# EAGLE design piboard (EAGLE 6.1)
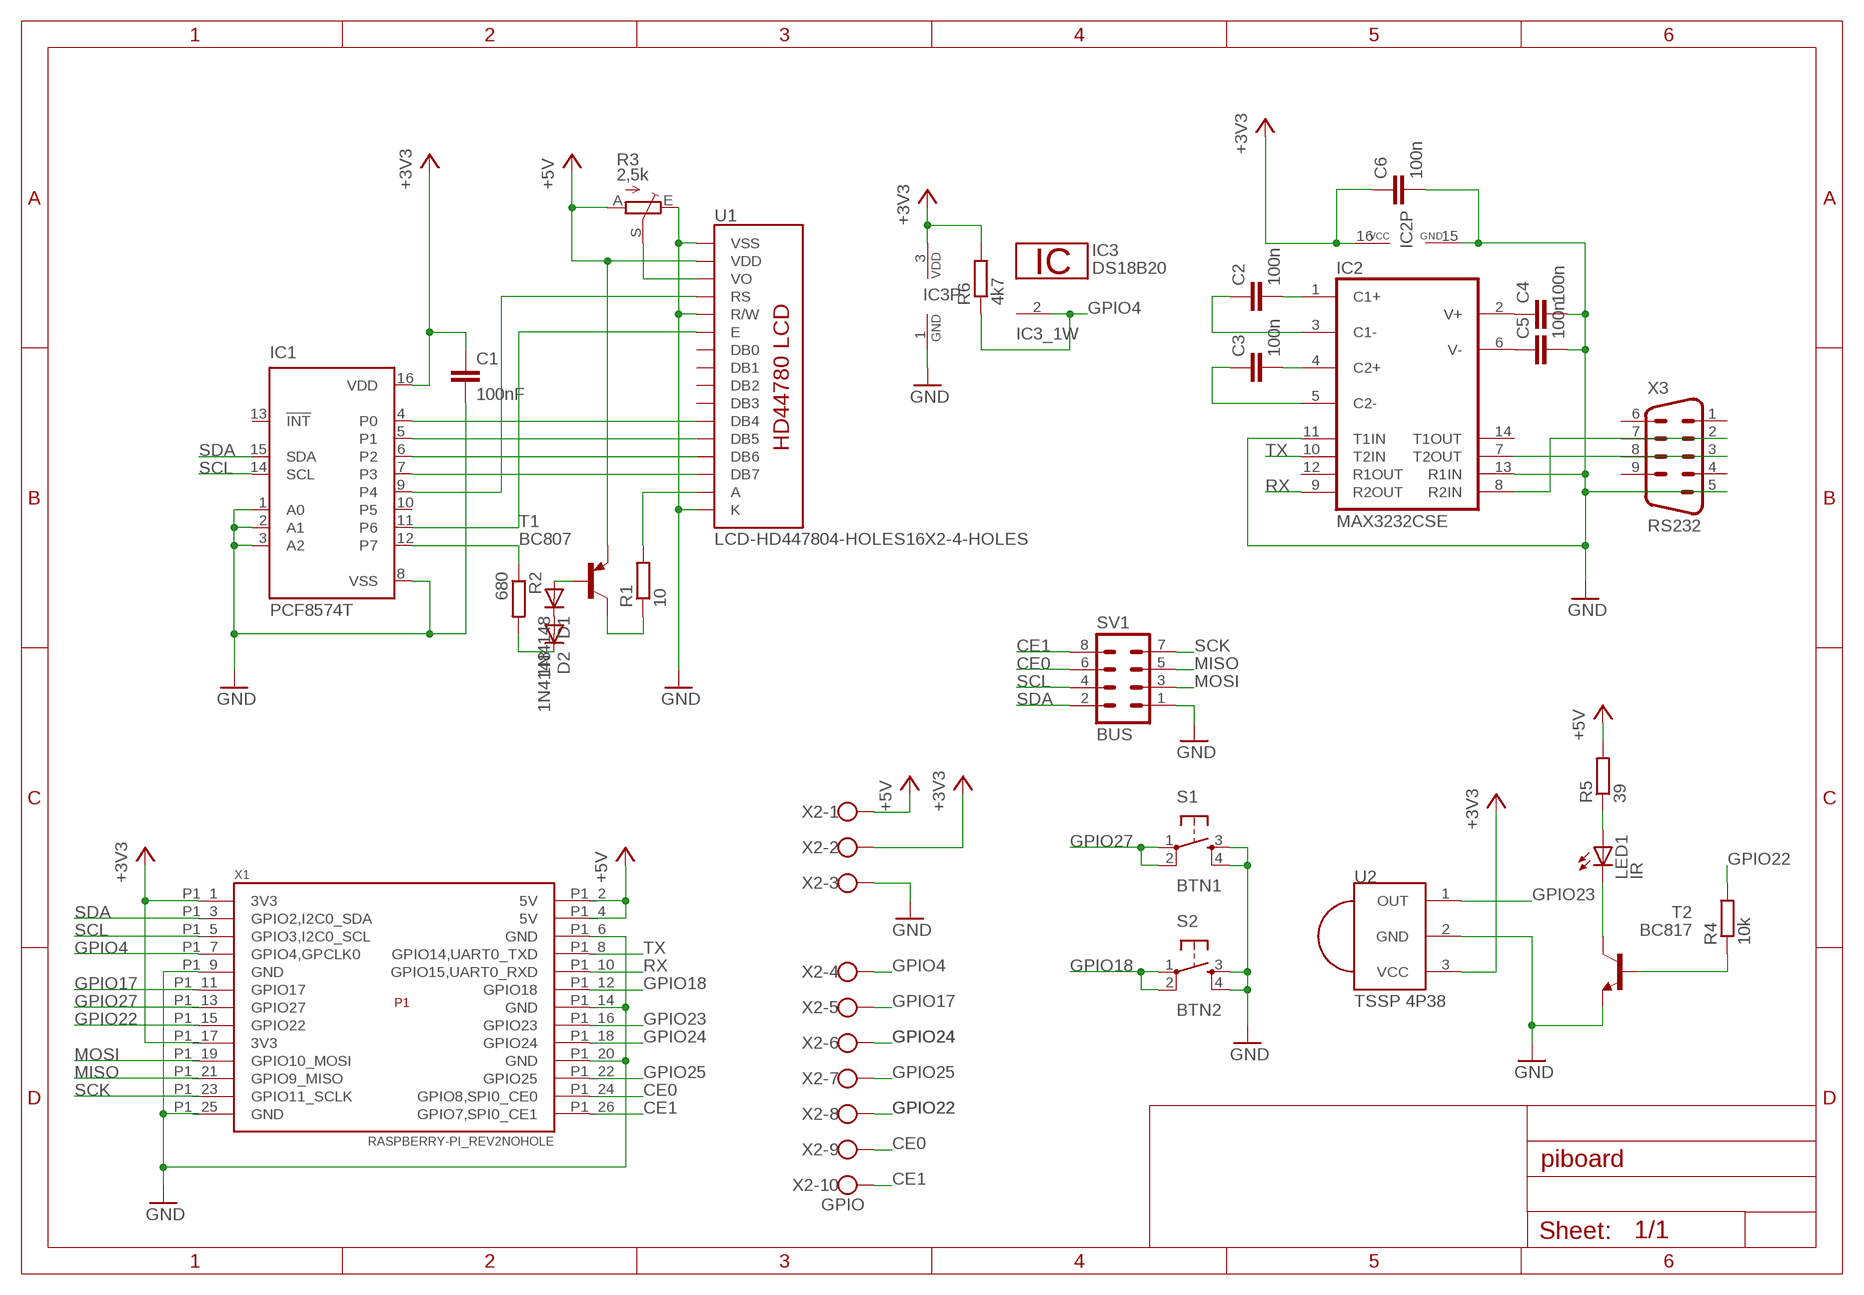
[diagram p0: schematic, sheet 1]

## Parts
C1  100nF  C-EUC0805  [C0805]
C2  100n  C-EUC0805  [C0805]
C3  100n  C-EUC0805  [C0805]
C4  100n  C-EUC0805  [C0805]
C5  100n  C-EUC0805  [C0805]
C6  100n  C-EUC0805  [C0805]
D1  1N4148  DIODE-SOD80C  [SOD80C]
D2  1N4148  DIODE-SOD80C  [SOD80C]
IC1  PCF8574T  [SO16W]
IC2  MAX3232CSE  [SO16]
IC3  DS18B20  [TO92-]
LED1  IR  LED5MM  [LED5MM]
R1  10  R-EU_R0805  [R0805]
R2  680  R-EU_R0805  [R0805]
R3  2,5k  TRIM_EU-2  [LI6]
R4  10k  R-EU_R0805  [R0805]
R5  39  R-EU_R0805  [R0805]
R6  4k7  R-EU_R0805  [R0805]
S1  BTN1  TAC_SWITCHPTH  [TACTILE-PTH]
S2  BTN2  TAC_SWITCHPTH  [TACTILE-PTH]
SV1  BUS  MA04-2  [MA04-2]
T1  BC807  BC807-16-PNP-SOT23-BEC  [SOT23-BEC]
T2  BC817  BC817-16-NPN-SOT23-BEC  [SOT23-BEC]
U1  LCD-HD447804-HOLES16X2-4-HOLES  [LCD-16X2-4HOLES]
U2  TSSP 4P38  PNA460XM  [PNA460XM]
X1  RASPBERRY-PI_REV2NOHOLE  [RASPBERRY-PI_REV2_NOHOLE]
X2  GPIO  AKL059-10  [RIA059-10]
X3  RS232  M09HP  [M09HP]

## Nets
+3V3: C1.1 C6.1 IC1.16(VDD) IC2.16(VCC) IC3.3 R6.2 U2.3(VCC) X1.P1_1(3V3) X1.P1_17(3V3) X2.2
+5V: R3.A R5.2 T1.E U1.2(VDD) X1.P1_2(5V) X1.P1_4(5V) X2.1
CE0: SV1.6 X1.P1_24(GPIO8,SPI0_CE0) X2.9
CE1: SV1.8 X1.P1_26(GPIO7,SPI0_CE1) X2.10
GND: C1.2 C4.2 C5.2 C6.2 IC1.1(A0) IC1.2(A1) IC1.3(A2) IC1.8(VSS) IC2.11(T1IN) IC2.13(R1IN) IC2.15(GND) IC3.1 R3.E S1.3 S1.4 S2.3 S2.4 SV1.1 T2.E U1.1(VSS) U1.5(R/W) U1.16(K) U2.2(GND) X1.P1_6(GND) X1.P1_9(GND) X1.P1_14(GND) X1.P1_20(GND) X1.P1_25(GND) X2.3 X3.5
GPIO4: IC3.2 R6.1 X1.P1_7(GPIO4,GPCLK0) X2.4
GPIO17: X1.P1_11(GPIO17) X2.5
GPIO18: S2.1 S2.2 X1.P1_12(GPIO18)
GPIO22: R4.2 X1.P1_15(GPIO22) X2.8
GPIO23: U2.1(OUT) X1.P1_16(GPIO23)
GPIO24: X1.P1_18(GPIO24) X2.6
GPIO25: X1.P1_22(GPIO25) X2.7
GPIO27: S1.1 S1.2 X1.P1_13(GPIO27)
MISO: SV1.5 X1.P1_21(GPIO9_MISO)
MOSI: SV1.3 X1.P1_19(GPIO10_MOSI)
N$1: R1.1 T1.C
N$2: IC1.9(P4) U1.4(RS)
N$3: IC1.4(P0) U1.11(DB4)
N$4: IC1.5(P1) U1.12(DB5)
N$5: IC1.6(P2) U1.13(DB6)
N$6: IC1.7(P3) U1.14(DB7)
N$7: IC1.11(P6) U1.6(E)
N$8: R1.2 U1.15(A)
N$9: IC1.12(P7) R2.1
N$10: D1.A T1.B
N$11: D1.C D2.A
N$12: D2.C R2.2
N$13: R3.S U1.3(VO)
N$14: C2.2 IC2.1(C1+)
N$15: C3.2 IC2.4(C2+)
N$16: C2.1 IC2.3(C1-)
N$17: C3.1 IC2.5(C2-)
N$18: IC2.7(T2OUT) X3.3
N$19: IC2.8(R2IN) X3.2
N$20: C4.1 IC2.2(V+)
N$21: C5.1 IC2.6(V-)
N$22: R4.1 T2.B
N$23: LED1.A R5.1
N$24: LED1.K(C) T2.C
RX: IC2.9(R2OUT) X1.P1_10(GPIO15,UART0_RXD)
SCK: SV1.7 X1.P1_23(GPIO11_SCLK)
SCL: IC1.14(SCL) SV1.4 X1.P1_5(GPIO3,I2C0_SCL)
SDA: IC1.15(SDA) SV1.2 X1.P1_3(GPIO2,I2C0_SDA)
TX: IC2.10(T2IN) X1.P1_8(GPIO14,UART0_TXD)
Unconnected: IC1.10(P5) IC1.13(!INT) IC2.12(R1OUT) IC2.14(T1OUT) U1.7(DB0) U1.8(DB1) U1.9(DB2) U1.10(DB3) X3.1 X3.4 X3.6 X3.7 X3.8 X3.9

## Library data of the parts
C1-C6 = resistor:C-EU: CAPACITOR, European symbol
D1 D2 = diode:DIODE-: DIODE
IC1 = micro-philips:PCF8574: I2C-Bus Remote 8-bit I/O expander http://www.semiconductors.philips.com/acrobat_download/datasheets/PCF8574_4.pdf; MPN: PCF8574T/3,512; OC_FARNELL: 1201255; OC_NEWARK: 70R6870
IC2 = maxim:MAX3232*: True RS-232 Transceivers 3.0V to 5.5V, Low-Power up to 1Mbps, Using Four 0.1µF External Capacitors Source: http://pdfserv.maxim-ic.com/en/ds/MAX3222-MAX3241.pdf; MPN: MAX3232CSE; OC_FARNELL: 9725490; OC_NEWARK: 90C2890
IC3 = 1wire:DS18B20: Programmable Resolution Digital Thermometer This chip provides a onewire thermosensor with approx. 0.5°C accuracy. A programmable over/undertemperure alarm is available. The precision can be set from 9..12 bits. Notes: Vdd must be applied for accurate measurements at low temperatures, as the parasite power circuit otherwise heats the sensor. If parasite power is used, Vdd has to be connected to GND. The DS1822 is a low-cost thermometer chip, the DS18S20 is similar to the DS18B20, but with 9 Bit precision only. Author: Jan Kandziora <jjj@gmx.de>
LED1 = led:LED: LED OSRAM: - CHIPLED LG R971, LG N971, LY N971, LG Q971, LY Q971, LO R971, LY R971 LH N974, LH R974 LS Q976, LO Q976, LY Q976 LO Q996 - Hyper CHIPLED LW Q18S LB Q993, LB Q99A, LB R99A - SideLED LS A670, LO A670, LY A670, LG A670, LP A670 LB A673, LV A673, LT A673, LW A673 LH A674 LY A675 LS A676, LA A676, LO A676, LY A676, LW A676 LS A679, LY A679, LG A679 - Hyper Micro SIDELED® LS Y876, LA Y876, LO Y876, LY Y876 LT Y87S - SmartLED LW L88C, LW L88S LB L89C, LB L89S, LG L890 LS L89K, LO L89K, LY L89K LS L896, LA L896, LO L896, LY L896 - TOPLED LS T670, LO T670, LY T670, LG T670, LP T670 LSG T670, LSP T670, LSY T670, LOP T670, LYG T670 LG T671, LOG T671, LSG T671 LB T673, LV T673, LT T673, LW T673 LH T674 LS T676, LA T676, LO T676, LY T676, LB T676, LH T676, LSB T676, LW T676 LB T67C, LV T67C, LT T67C, LS T67K, LO T67K, LY T67K, LW E67C LS E67B, LA E67B, LO E67B, LY E67B, LB E67C, LV E67C, LT E67C LW T67C LS T679, LY T679, LG T679 LS T770, LO T770, LY T770, LG T770, LP T770 LB T773, LV T773, LT T773, LW T773 LH T774 LS E675, LA E675, LY E675, LS T675 LS T776, LA T776, LO T776, LY T776, LB T776 LHGB T686 LT T68C, LB T68C - Hyper Mini TOPLED® LB M676 - Mini TOPLED Santana® LG M470 LS M47K, LO M47K, LY M47K Source: http://www.osram.convergy.de LUXEON: - LUMILED® LXK2-PW12-R00, LXK2-PW12-S00, LXK2-PW14-U00, LXK2-PW14-V00 LXK2-PM12-R00, LXK2-PM12-S00, LXK2-PM14-U00 LXK2-PE12-Q00, LXK2-PE12-R00, LXK2-PE12-S00, LXK2-PE14-T00, LXK2-PE14-U00 LXK2-PB12-K00, LXK2-PB12-L00, LXK2-PB12-M00, LXK2-PB14-N00, LXK2-PB14-P00, LXK2-PB14-Q00 LXK2-PR12-L00, LXK2-PR12-M00, LXK2-PR14-Q00, LXK2-PR14-R00 LXK2-PD12-Q00, LXK2-PD12-R00, LXK2-PD12-S00 LXK2-PH12-R00, LXK2-PH12-S00 LXK2-PL12-P00, LXK2-PL12-Q00, LXK2-PL12-R00 Source: www.luxeon.com KINGBRIGHT: KA-3528ASYC Source: www.kingbright.com
R1 R2 R4-R6 = resistor:R-EU_: RESISTOR, European symbol
R3 = pot-2:TRIM_EU-2: POTENTIOMETER Edited by Endres
S1 S2 = SparkFun_eagle5:TAC_SWITCH: Momentary Switch Button commonly used for reset or general input. Spark Fun Electronics SKU : COM-00097
SV1 = con-lstb:MA04-2: PIN HEADER; OC_FARNELL: unknown; OC_NEWARK: unknown
T1 = transistor:*-PNP-: PNP Transistror
T2 = transistor:*-NPN-: NPN Transistror BF959 corrected 2008.03.06
U1 = HD44780LCD:LCD-HD44780
U2 = adafruit-eagle610:PNA460XM: IR 38KHz receiver PNA4602 and related receivers http://www.ladyada.net/library/pcb/eaglelibrary.html
X1 = RaspberryPi_withoutP5:RASPBERRY-PI_REV2: Raspberry Pi Board <http://www.raspberrypi.org/> Jacques Lagnel V1.0 (beta) 2012 Mateusz Bawaj V1.1 (beta) 2012 Board dimension: Forum 3D model <http://www.raspberrypi.org/forum/general-discussion/mechanical-profile-3d-models?value=3d%20model&type=1&include=1&search=1&ret=all> The GPIO Connector (P1): http://elinux.org/RPi_Low-level_peripherals The GPIO Connector (P5): http://www.raspberrypi-spy.co.uk/2012/09/raspberry-pi-p5-header/
X2 = con-reichelt2:AKL059-10: Reichelt: AKL 059-04; OC_FARNELL: unknown; OC_NEWARK: unknown
X3 = con-subd:M09: SUB-D; OC_FARNELL: unknown; OC_NEWARK: unknown

## Board
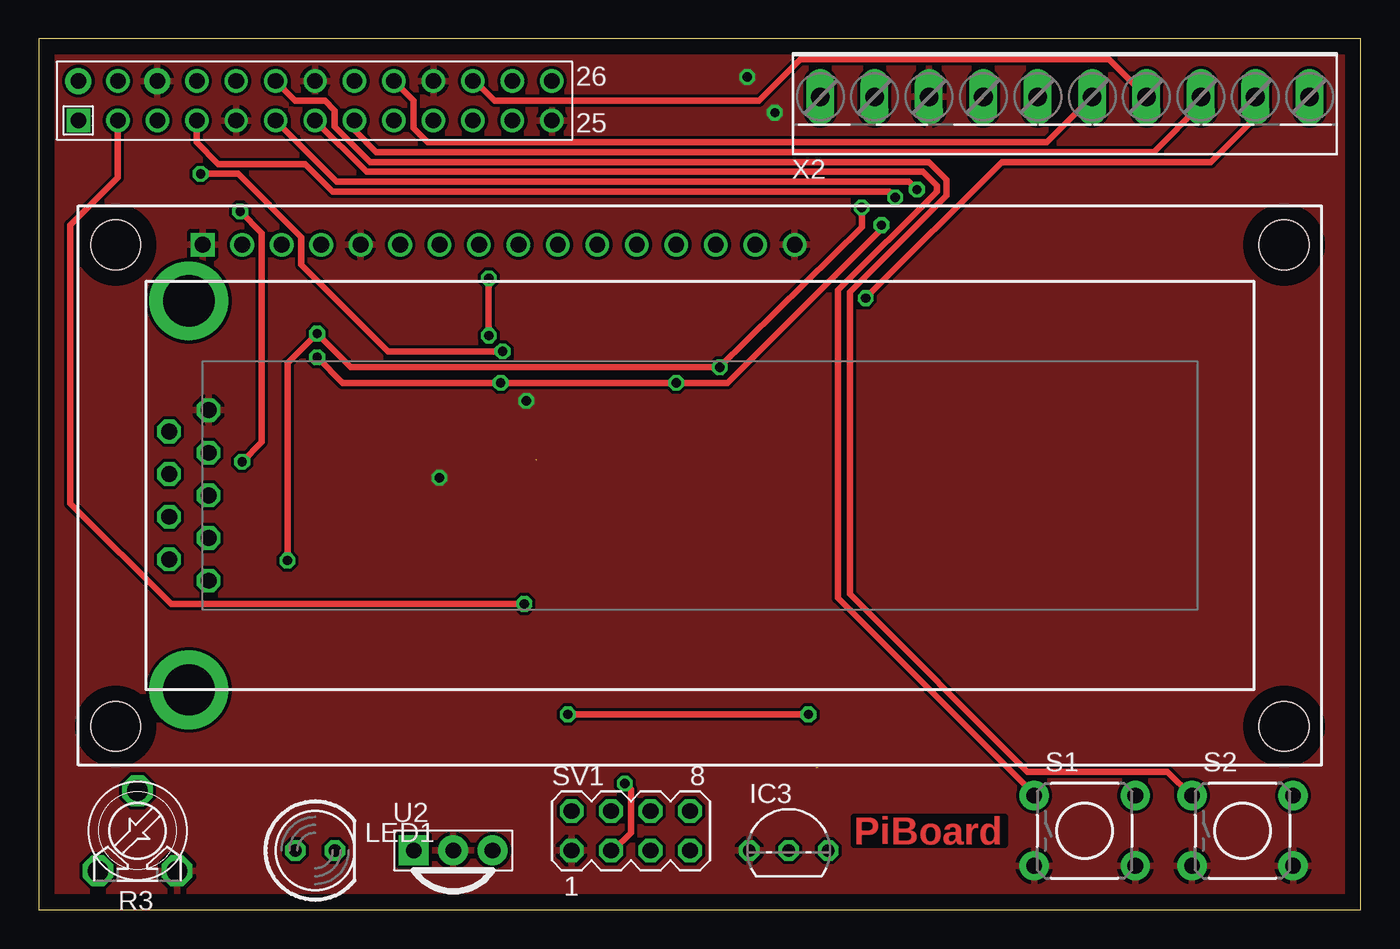
[diagram p1: board, top side]
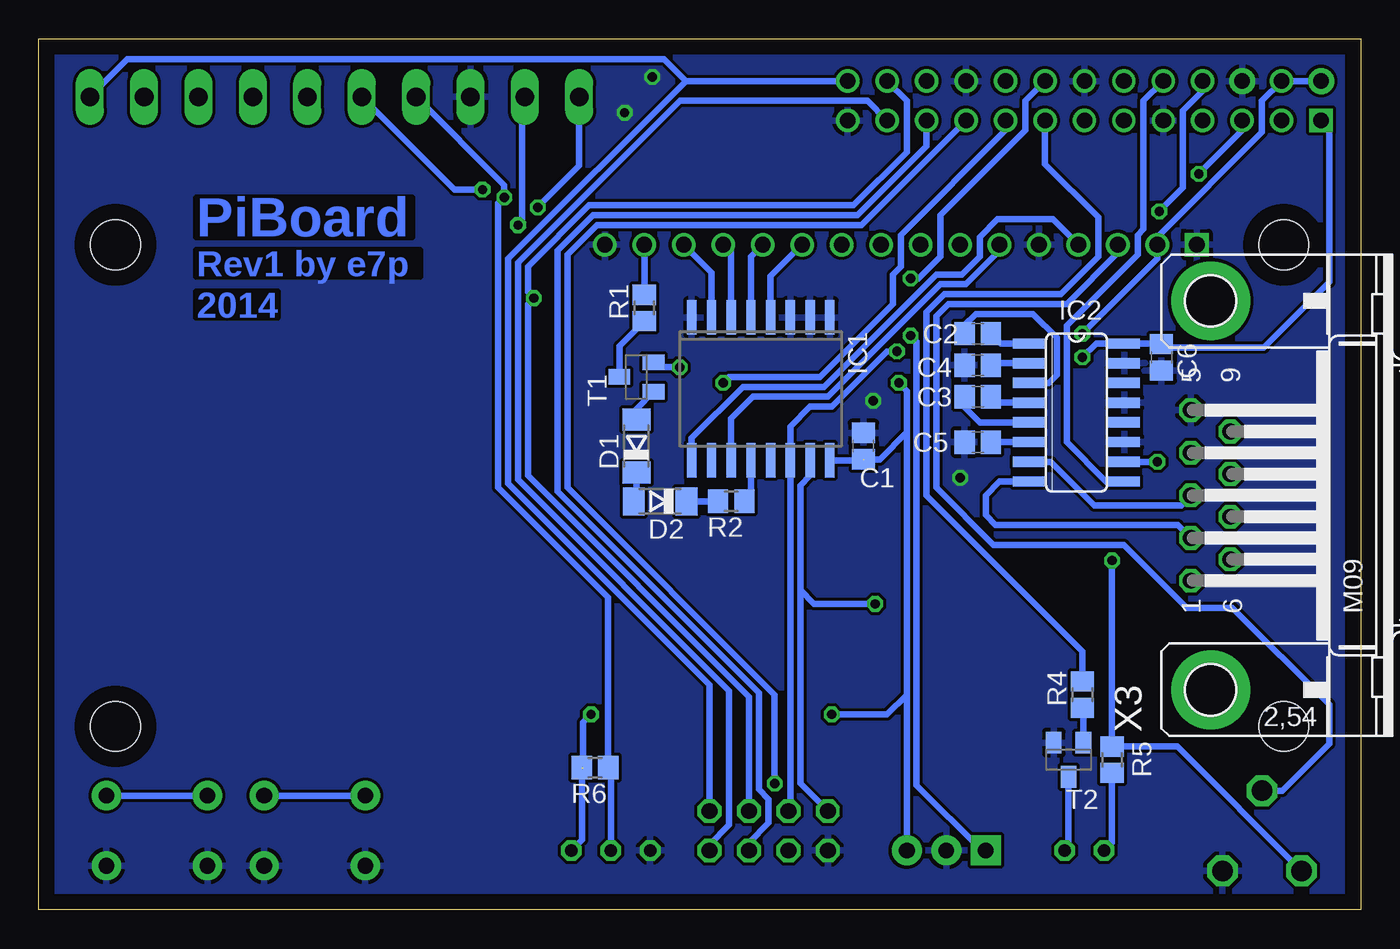
[diagram p2: board, bottom side, seen from below]

Size 85.07 x 56.06 mm. Coordinates in mm from the lower left corner, seen from the top.
Outline: 0,0 85.07,0 85.07,56.06 0,56.06 0,0
Copper layers (1*16): Top 0.035mm / dielectric 1.5mm / Bottom 0.035mm
Design rules: minimum track width 10mil, minimum drill 0.3mm, track to track 8mil, track to pad 8mil, pad to pad 8mil, via to via 8mil, smd to smd 8mil, copper to edge 40mil, drill to drill 8mil, minimum pad ring 10mil, minimum via ring 8mil, stop-mask expansion 4mil, vias tented up to drill 0mil, thermal gap 10mil
Milling: 4 lines

### Footprints (pad centres in the part's own frame; a part is rotated, then mirrored left to right if it is on the bottom)
C0805 = smd 1.3 x 1.5: 1 -0.85,0; 2 0.85,0
SOD80C = smd 1.4 x 1.8: A 1.7,0; C -1.7,0
SO16W = smd 0.6 x 2.2: 1 -4.445,-4.6; 2 -3.175,-4.6; 3 -1.905,-4.6; 4 -0.635,-4.6; 5 0.635,-4.6; 6 1.905,-4.6; 7 3.175,-4.6; 8 4.445,-4.6; 9 4.445,4.6; 10 3.175,4.6; 11 1.905,4.6; 12 0.635,4.6; 13 -0.635,4.6; 14 -1.905,4.6; 15 -3.175,4.6; 16 -4.445,4.6
SO16 = smd 0.66 x 2.032: 1 -4.445,-3.073; 2 -3.175,-3.073; 3 -1.905,-3.073; 4 -0.635,-3.073; 5 0.635,-3.073; 6 1.905,-3.073; 7 3.175,-3.073; 8 4.445,-3.073; 9 4.445,3.073; 10 3.175,3.073; 11 1.905,3.073; 12 0.635,3.073; 13 -0.635,3.073; 14 -1.905,3.073; 15 -3.175,3.073; 16 -4.445,3.073
TO92- = drill 0.813 octagon: 1 -2.54,0; 2 0,0; 3 2.54,0
LED5MM = drill 0.813 octagon: A -1.27,0; K 1.27,0
R0805 = smd 1.3 x 1.5: 1 -0.85,0; 2 0.85,0
LI6 = drill 1.321 octagon: A -2.54,-2.58; E 2.54,-2.58; S 0,2.58
TACTILE-PTH = drill 1.016 pad 1.88: 1 -3.251,2.261; 2 3.251,2.261; 3 -3.251,-2.261; 4 3.251,-2.261
MA04-2 = drill 1.016 octagon: 1 -3.81,-1.27; 2 -3.81,1.27; 3 -1.27,-1.27; 4 -1.27,1.27; 5 1.27,-1.27; 6 1.27,1.27; 7 3.81,-1.27; 8 3.81,1.27
SOT23-BEC = smd 1 x 1.4: B -0.95,-1.1; C 0,1.1; E 0.95,-1.1
LCD-16X2-4HOLES = drill 1.016 square: 1 -32,15.5 | drill 1.016: 2 -29.46,15.5; 3 -26.92,15.5; 4 -24.38,15.5; 5 -21.84,15.5; 6 -19.3,15.5; 7 -16.76,15.5; 8 -14.22,15.5; 9 -11.68,15.5; 10 -9.14,15.5; 11 -6.6,15.5; 12 -4.06,15.5; 13 -1.52,15.5; 14 1.02,15.5; 15 3.56,15.5; 16 6.1,15.5 | hole 3.2: -37.6,15.5; -37.6,-15.5; 37.6,-15.5; 37.6,15.5
PNA460XM = drill 1.016 pad 1.93 square: 1 -2.54,0 | drill 1.016 pad 1.93: 2 0,0; 3 2.54,0
RASPBERRY-PI_REV2_NOHOLE = drill 1 square: P1_1 -41.91,21.59 | drill 1 pad 1.676: P1_2 -41.91,24.13; P1_6 -36.83,24.13 | drill 1: P1_3 -39.37,21.59; P1_4 -39.37,24.13; P1_5 -36.83,21.59; P1_7 -34.29,21.59; P1_8 -34.29,24.13; P1_9 -31.75,21.59; P1_10 -31.75,24.13; P1_11 -29.21,21.59; P1_12 -29.21,24.13; P1_13 -26.67,21.59; P1_14 -26.67,24.13; P1_15 -24.13,21.59; P1_16 -24.13,24.13; P1_17 -21.59,21.59; P1_18 -21.59,24.13; P1_19 -19.05,21.59; P1_20 -19.05,24.13; P1_21 -16.51,21.59; P1_22 -16.51,24.13; P1_23 -13.97,21.59; P1_24 -13.97,24.13; P1_25 -11.43,21.59; P1_26 -11.43,24.13
RIA059-10 = drill 1.194 long: 1 -15.75,-1.27; 2 -12.25,-1.27; 3 -8.75,-1.27; 4 -5.25,-1.27; 5 -1.75,-1.27; 6 1.75,-1.27; 7 5.25,-1.27; 8 8.75,-1.27; 9 12.25,-1.27; 10 15.75,-1.27
M09HP = drill 1.016 octagon: 1 -5.486,1.27; 2 -2.743,1.27; 3 0,1.27; 4 2.743,1.27; 5 5.486,1.27; 6 -4.115,-1.27; 7 -1.372,-1.27; 8 1.372,-1.27; 9 4.115,-1.27 | drill 3.302 pad 5.08: G1 -12.522,0; G2 12.522,0

### Placement (x,y rotation side)
C1  32,29.84 90 bottom
C2  24.64,37.08 0 bottom
C3  24.64,33.02 0 bottom
C4  24.64,35.05 180 bottom
C5  24.64,30.1 180 bottom
C6  12.83,35.56 270 bottom
D1  46.61,29.84 90 bottom
D2  45.09,26.29 180 bottom
IC1  38.61,33.53 180 bottom
IC2  18.29,32 270 bottom
IC3  48.26,3.81 0 top
LED1  17.78,3.81 0 top
R1  46.1,38.73 90 bottom
R2  40.51,26.29 180 bottom
R3  6.35,5.08 0 top
R4  17.91,13.84 90 bottom
R5  16,9.65 90 bottom
R6  49.28,9.14 180 bottom
S1  67.31,5.08 0 top
S2  77.47,5.08 0 top
SV1  38.1,5.08 0 top
T1  46.61,34.29 90 bottom
T2  18.8,9.65 180 bottom
U1  42.55,27.3 0 top
U2  26.67,3.81 0 top
X1  44.45,29.21 0 top
X2  66.04,53.59 0 top
X3  9.65,26.67 90 bottom

### Tracks (layer width: path | path; a pad name or v marks a point on that pad's centre or on a via)
+3V3  (via drill 0.6)  (2 unrouted)
  Top 0.406: v17.91,35.56 19.56,33.91 v29.72,33.91 v41.02,33.91 44.32,33.91 54.23,43.81 v54.23,44.07 | v49.53,12.57 v34.04,12.57
  Bottom 0.406: X1.P1_1 2.03,50.29 2.03,40.39 6.22,36.2 12.19,36.2 12.41,36.41 C6.1 12.61,36.45 IC2.16 17.02,36.45 v17.91,35.56 | IC1.16 32.16,28.93 32.13,28.96 32,28.96 | U2.3 29.21,13.84 | 29.21,13.84 29.21,30.73 | 29.21,30.73 30.95,29 C1.1 | R6.2 50.13,4.48 IC3.3 | 29.21,30.73 29.21,33.4 v29.72,33.91 | v34.04,12.57 30.48,12.57 29.21,13.84 | 50.04,9.14 50.04,12.06 v49.53,12.57 | v54.23,44.07 53.98,44.32 53.98,52.14 X2.2 | X1.P1_17 22.86,50.16 29.59,43.43 29.59,41.4 30.1,40.89 30.1,38.99 34.8,34.29 40.64,34.29 v41.02,33.91
+5V  (via drill 0.6)
  Top 0.406: v16,22.48 16,35.18 v17.91,37.08 20.07,34.92 v43.81,34.92 52.96,43.94 v52.96,45.21
  Bottom 0.406: X1.P1_2 X1.P1_4 6.35,52.07 6.35,50.04 13.09,43.3 U1.2 13.09,41.91 v17.91,37.08 | R3.A 11.81,10.5 R5.2 v16,22.48 | v43.81,34.92 45.19,34.92 T1.E | X2.1 50.29,47.88 v52.96,45.21
CE0  (via drill 0.6)
  Top 0.406: X2.9 78.29,50.98 75.44,48.13 61.98,48.13 v53.21,39.37
  Bottom 0.406: SV1.6 39.37,13.72 53.59,27.94 53.59,38.99 v53.21,39.37 53.59,39.75 53.59,41.4 49.66,45.34 32.64,45.34 29.21,48.77 29.21,52.07 X1.P1_24
CE1
  Bottom 0.406: X1.P1_26 43.43,53.34 | 43.43,53.34 44.83,54.74 79.38,54.74 X2.10 | SV1.8 41.91,14.48 54.86,27.43 54.86,41.91 43.43,53.34
GND  (via drill 0.6)
  other vias: 25.78,27.81 31.37,32.77 45.59,53.59 47.37,51.31
  pour Bottom: 0,0 0,56.01 85.09,56.01 85.09,0
  pour Top: 0,0 0,56.01 85.09,56.01 85.09,0
GPIO4  (via drill 0.6)
  Top 0.406: X1.P1_7 10.16,49.4 11.56,48.01 17.14,48.01 18.92,46.23 54.74,46.23 v55.12,45.85
  Bottom 0.406: IC3.2 48.26,8.98 R6.1 48.43,20.11 55.5,27.18 55.5,45.47 v55.12,45.85 55.12,46.65 X2.4
GPIO17  (via drill 0.6)
  Top 0.406: X1.P1_11 19.18,46.86 56.01,46.86 v56.52,46.35
  Bottom 0.406: v56.52,46.35 58.32,46.35 X2.5
GPIO18
  Top 0.406: S2.1 74.19,7.34 72.64,8.89 63.63,8.89 52.2,20.32 52.2,39.75 58.42,45.97 58.42,46.99 57.28,48.13 21.34,48.13 19.05,50.42 19.05,51.44 18.41,52.07 16.51,52.07 X1.P1_12
  Bottom 0.406: S2.2 S2.1
GPIO22
  Top 0.406: X2.8 74.79,51.8 71.75,48.77 21.72,48.77 20.32,50.16 X1.P1_15
  Bottom 0.406: R4.2 17.91,16.64 27.94,26.67 27.94,38.48 26.8,39.62 19.3,39.62 16.89,42.04 16.89,44.58 20.32,48.01 X1.P1_15
GPIO23  (via drill 0.6)
  Top 0.406: v28.96,36.96 v28.96,40.64
  Bottom 0.406: U2.1 24.38,3.81 28.57,8 28.57,36.58 v28.96,36.96 | v28.96,40.64 28.45,40.64 27.05,42.04 27.05,44.7 21.59,50.16 21.59,52.07 X1.P1_16
GPIO24
  Top 0.406: X1.P1_18 24.13,52.07 24.13,50.29 25.02,49.4 64.87,49.4 X2.6
GPIO25
  Top 0.406: X1.P1_22 28.07,53.34 29.34,52.07 46.35,52.07 49.02,54.74 68.88,54.74 X2.7
GPIO27
  Top 0.406: S1.1 64.06,7.44 51.44,20.07 51.44,39.88 57.78,46.23 57.78,46.61 56.9,47.5 21.08,47.5 X1.P1_13
  Bottom 0.406: S1.2 S1.1
MISO
  Bottom 0.406: SV1.5 39.37,4.32 38.1,5.59 38.1,7.11 38.73,7.75 38.73,13.97 51.69,26.92 51.69,42.42 49.4,44.7 32.38,44.7 27.94,49.15 X1.P1_21
MOSI  (via drill 0.6)
  Top 0.406: SV1.3 36.96,3.81 38.1,4.95 38.1,7.75 v37.72,8.13
  Bottom 0.406: v37.72,8.13 37.72,13.84 51.05,27.18 51.05,42.16 49.15,44.07 32.13,44.07 X1.P1_19
N$1
  Bottom 0.406: T1.C 47.71,36.28 R1.1
N$2
  Bottom 0.406: IC1.9 43.05,30.35 39.75,33.66 34.54,33.66 27.3,40.89 25.65,40.89 24.51,42.04 24.51,43.31 23.37,44.45 19.81,44.45 U1.4
N$3
  Bottom 0.406: IC1.4 37.97,40.78 U1.11
N$4
  Bottom 0.406: IC1.5 39.24,42.05 U1.12
N$5
  Bottom 0.406: IC1.6 40.51,42.29 U1.13
N$6
  Bottom 0.406: IC1.7 41.78,41.02 U1.14
N$7
  Bottom 0.406: IC1.11 40.51,31.62 39.12,33.02 34.29,33.02 27.05,40.26 25.4,40.26 23.25,42.41 U1.6
N$8
  Bottom 0.406: R1.2 U1.15
N$9
  Bottom 0.406: IC1.12 39.24,26.71 R2.1
N$10
  Bottom 0.406: D1.A 46.61,32.24 T1.B
N$11
  Bottom 0.406: D1.C 46.61,26.46 D2.A
N$12
  Bottom 0.406: D2.C R2.2
N$13
  Bottom 0.406: R3.S 5.04,7.66 2.03,10.67 2.03,13.21 8.26,19.43 11.18,19.43 15.24,23.5 23.62,23.5 27.3,27.18 27.3,38.23 26.54,38.99 18.92,38.99 15.63,42.29 U1.3
N$14
  Bottom 0.406: IC2.1 23.15,36.45 C2.2
N$15
  Bottom 0.406: IC2.4 23.41,32.64 C3.2
N$16
  Bottom 0.406: C2.1 25.49,37.63 24.77,38.35 21.08,38.35 19.56,36.83 19.56,34.42 20.07,33.91 IC2.3
N$17
  Bottom 0.406: IC2.5 24.51,31.37 25.53,32.38 25.53,32.98 C3.1
N$18
  Bottom 0.406: X3.3 11.56,26.04 17.14,26.04 19.94,28.83 IC2.7
N$19
  Bottom 0.406: X3.2 11.76,24.77 23.5,24.77 24.13,25.4 24.13,26.67 23.24,27.56 IC2.8
N$20
  Bottom 0.406: IC2.2 23.66,35.18 C4.1
N$21
  Bottom 0.406: IC2.6 C5.1
N$22
  Bottom 0.406: T2.B 17.85,12.93 R4.1
N$23
  Bottom 0.406: R5.1 16,4.32 LED1.A
N$24
  Bottom 0.406: T2.C 18.8,4.06 LED1.K
RX
  Bottom 0.406: IC2.9 16.38,27.56 18.92,30.1 18.92,37.59 14.35,42.16 14.35,43.43 13.97,43.81 13.97,52.07 X1.P1_10
SCK
  Bottom 0.406: SV1.7 41.91,4.19 40.64,5.46 40.64,14.1 54.23,27.69 54.23,41.66 43.81,52.07 31.75,52.07 X1.P1_23
SCL  (via drill 0.6)
  Top 0.406: v10.41,47.37 12.83,47.37 16.89,43.31 16.89,41.53 22.48,35.94 v29.84,35.94
  Bottom 0.406: SV1.4 36.7,6.48 IC1.14 36.7,31.11 35.43,32.38 34.04,32.38 30.48,35.94 v29.84,35.94 | X1.P1_5 7.62,50.16 v10.41,47.37
SDA  (via drill 0.6)
  Top 0.406: X1.P1_3 5.08,47.12 2.03,44.07 2.03,26.16 8.51,19.68 v31.24,19.68
  Bottom 0.406: SV1.2 36.07,8.13 36.07,20.57 | 36.07,20.57 36.07,27.3 35.43,27.94 IC1.15 | v31.24,19.68 35.18,19.68 36.07,20.57
TX  (via drill 0.6)
  Top 0.406: v12.95,44.96 14.35,43.56 14.35,30.1 v13.08,28.83
  Bottom 0.406: X1.P1_8 10.16,52.7 11.43,51.44 11.43,46.48 v12.95,44.96 | v13.08,28.83 IC2.10

### Text on the board
Top: PiBoard
Bottom: PiBoard | Rev1 by e7p | 2014
Document: 5V | 3V3 | GND | #4 | #17 | #24 | #25 | #22 | #8 | #7